# Altium schematic sheet DRV8301.SchDoc
size A3; SheetNumber: 4; SheetTotal: 5
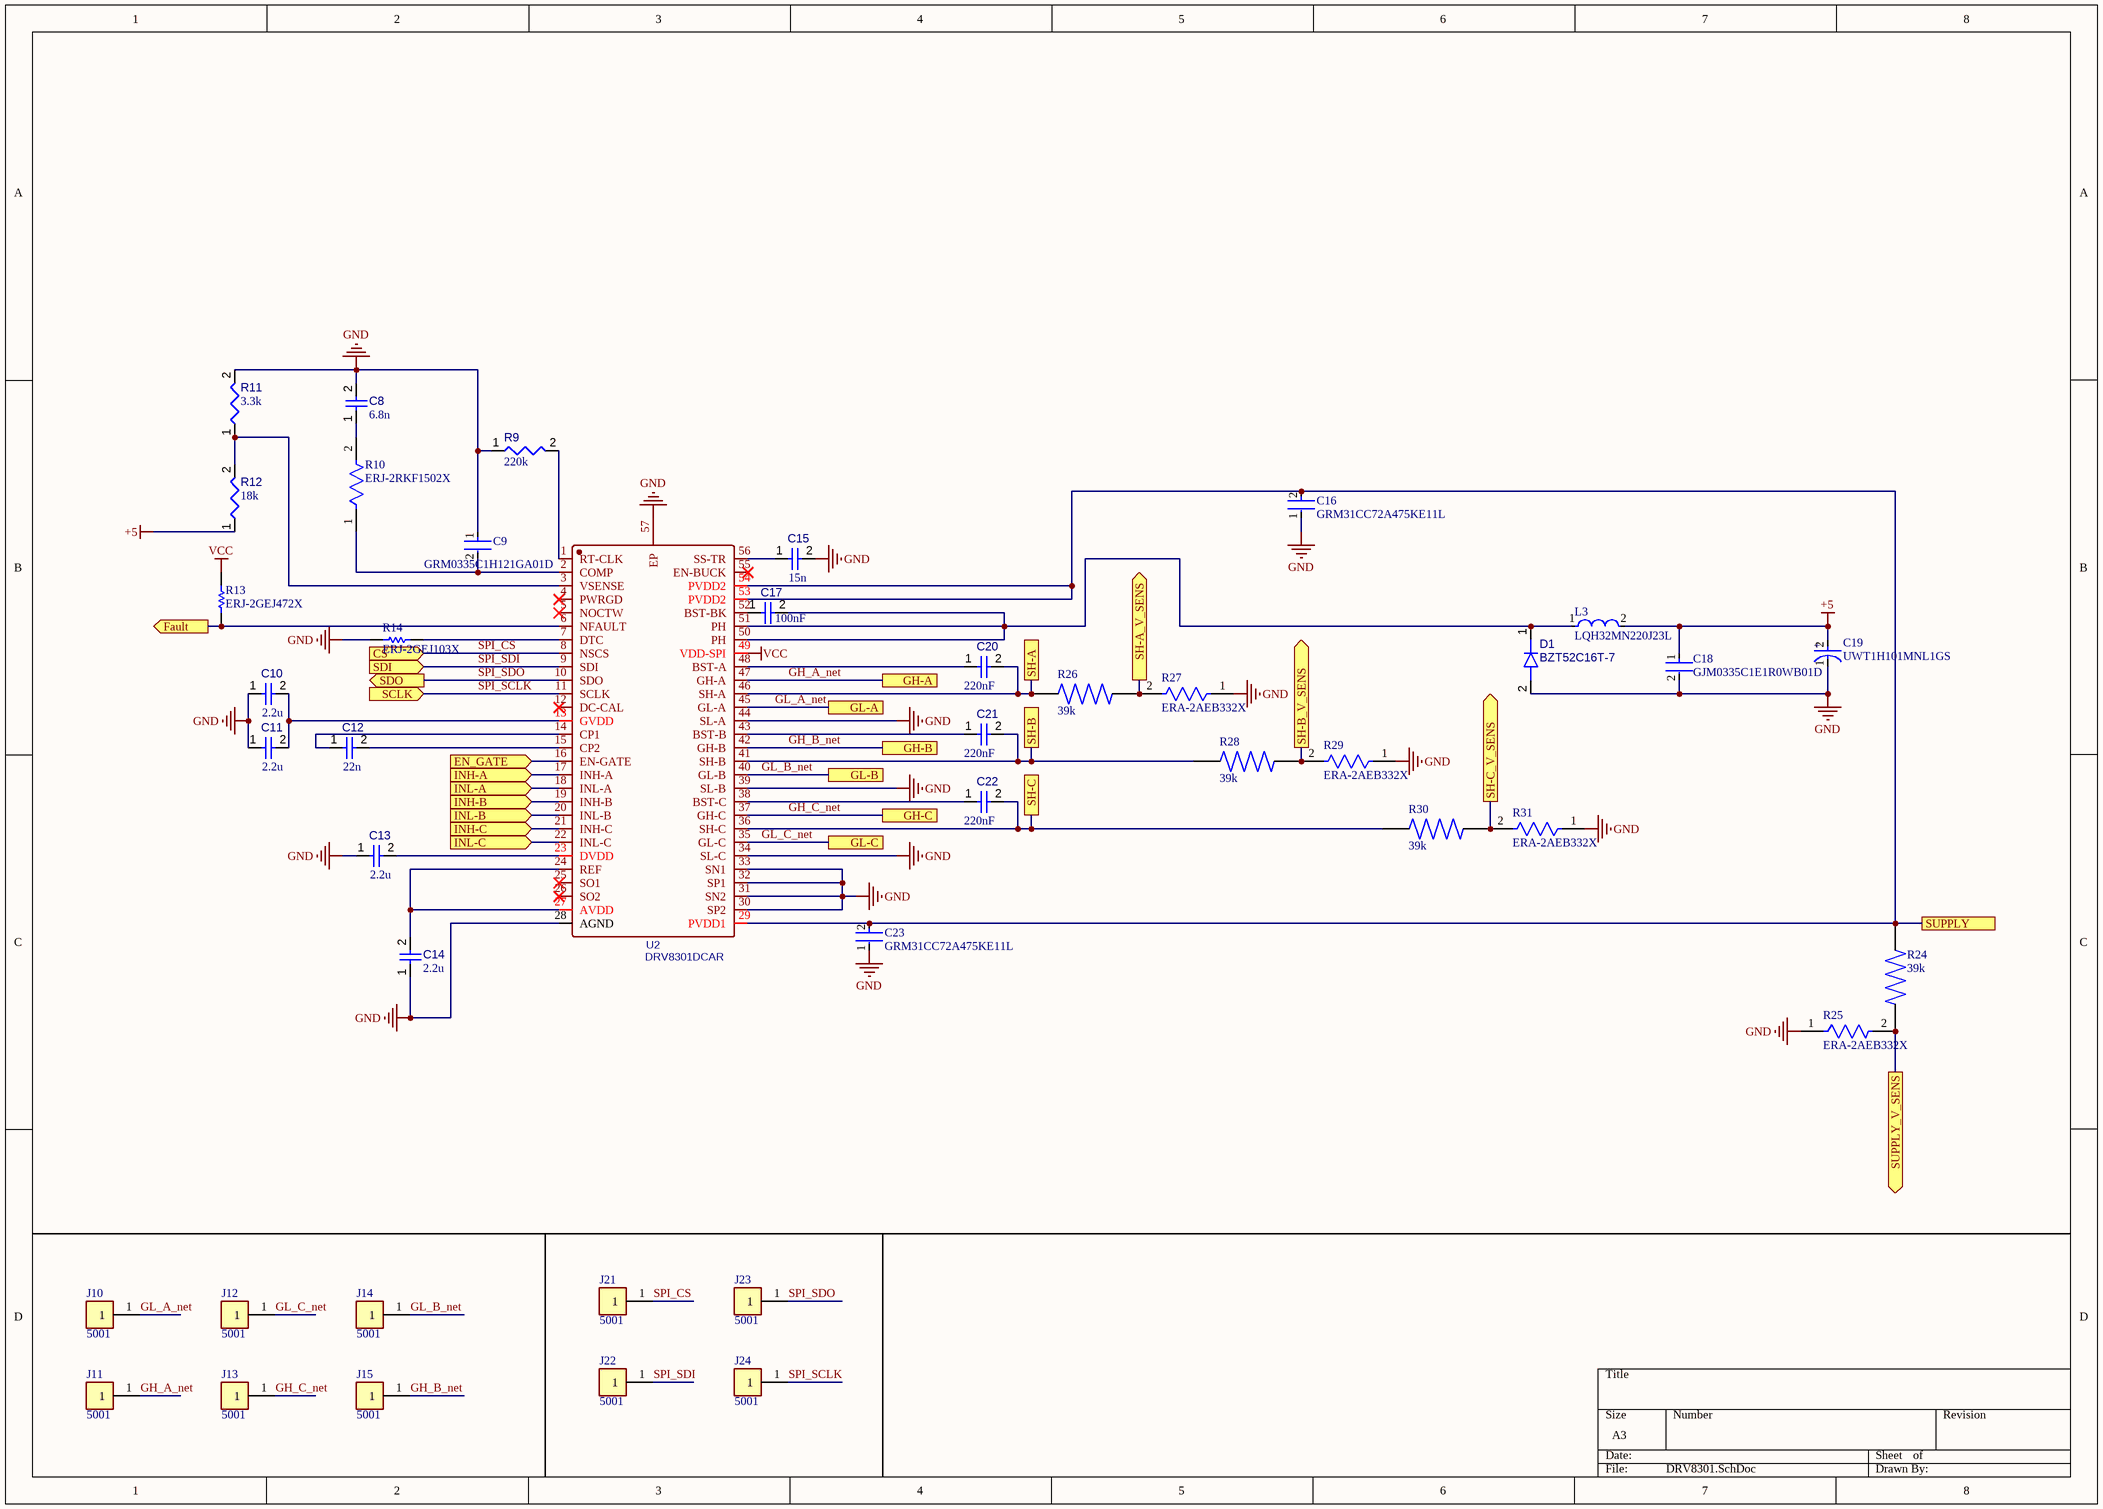
[diagram p0: DRV8301.SchDoc]

## Parts
C8  value 6.8n  [CAP-0402]  (hidden comment: C0402C682K5RECAUTO)
C9  GRM0335C1H121GA01D  [FP-GRM033-0_03-IPC_A]
C10  value 2.2u  [CAP-0805]  (hidden comment: C0805C225J4REC7800)
C11  value 2.2u  [CAP-0805]  (hidden comment: C0805C225J4REC7800)
C12  value 22n  [CAP-0402]  (hidden comment: C0402C223K5RECAUTO)
C13  value 2.2u  [CAP-0805]  (hidden comment: C0805C225J4REC7800)
C14  value 2.2u  [CAP-0805]  (hidden comment: C0805C225J4REC7800)
C15  value 15n  [CAP-0402]  (hidden comment: C0402C153J5REC7867)
C16  GRM31CC72A475KE11L  [FP-GRM31C-0_3-e0_3_0_9-MFG]
C17  value 100nF  [CAP-0805]  (hidden comment: MT05B104M500BD)
C18  GJM0335C1E1R0WB01D  [FP-GJM033-0_03-IPC_A]
C19  UWT1H101MNL1GS  [FP-UWT1H101MNL1GS-MFG]
C20  value 220nF  [CAP-0805]  (hidden comment: C0805C224J1REC7800)
C21  value 220nF  [CAP-0805]  (hidden comment: C0805C224J1REC7800)
C22  value 220nF  [CAP-0805]  (hidden comment: C0805C224J1REC7800)
C23  GRM31CC72A475KE11L  [FP-GRM31C-0_3-e0_3_0_9-MFG]
D1  BZT52C16T-7  [SODFL160X65-2N]
J10  5001  [FP-5001-MFG]
J11  5001  [FP-5001-MFG]
J12  5001  [FP-5001-MFG]
J13  5001  [FP-5001-MFG]
J14  5001  [FP-5001-MFG]
J15  5001  [FP-5001-MFG]
J21  5001  [FP-5001-MFG]
J22  5001  [FP-5001-MFG]
J23  5001  [FP-5001-MFG]
J24  5001  [FP-5001-MFG]
L3  LQH32MN220J23L  [FP-LQH32CH_23-MFG]
R9  value 220k  [CAP-0603]  (hidden comment: WR06X2203FTL)
R10  ERJ-2RKF1502X  [FP-ERJ2R-MFG]
R11  value 3.3k  [CAP-0603]  (hidden comment: RMCF0603FT3K30)
R12  value 18k  [CAP-0603]  (hidden comment: RMCF0603FT18K0)
R13  ERJ-2GEJ472X  [RESC1005X40X25LL05T05]
R14  ERJ-2GEJ103X  [RESC1005X40X25ML05T05]
R24  value 39k  [RESC6332X120N]  (hidden comment: 352239KJT)
R25  ERA-2AEB332X  [FP-ERA2A-MFG]
R26  value 39k  [RESC6332X120N]  (hidden comment: 352239KJT)
R27  ERA-2AEB332X  [FP-ERA2A-MFG]
R28  value 39k  [RESC6332X120N]  (hidden comment: 352239KJT)
R29  ERA-2AEB332X  [FP-ERA2A-MFG]
R30  value 39k  [RESC6332X120N]  (hidden comment: 352239KJT)
R31  ERA-2AEB332X  [FP-ERA2A-MFG]
U2  DRV8301DCAR  [IC-HTSSOP-56-THERM]

## Ports
CS (in), EN_GATE (in), Fault (out), GH-A, GH-B, GH-C, GL-A, GL-B, GL-C, INH-A (in), INH-B (in), INH-C (in), INL-A (in), INL-B (in), INL-C (in), SCLK (in), SDI (in), SDO (out), SH-A, SH-A_V_SENS (out), SH-B, SH-B_V_SENS (out), SH-C, SH-C_V_SENS (out), SUPPLY, SUPPLY_V_SENS (out)

## Nets
+5: C18.1 C19.2(A) L3.2 R12.1
GND: C8.2 C9.1 C10.1 C11.1 C13.1 C14.1 C15.2 C16.1 C18.2 C19.1(C) C23.1 D1.2(A) R9.1 R11.2 R14.1 R25.1 R27.1 R29.1 R31.1 U2.28(AGND) U2.30(SP2) U2.31(SN2) U2.32(SP1) U2.33(SN1) U2.34(SL-C) U2.39(SL-B) U2.44(SL-A) U2.57(EP)
VCC: R13.2 U2.49(VDD-SPI)
EN_GATE: U2.16(EN-GATE) ; port EN_GATE
Fault: R13.1 U2.6(NFAULT) ; port Fault
GH_A_net: J11.1 U2.47(GH-A) ; port GH-A
GH_B_net: J15.1 U2.42(GH-B) ; port GH-B
GH_C_net: J13.1 U2.37(GH-C) ; port GH-C
GL_A_net: J10.1 U2.45(GL-A) ; port GL-A
GL_B_net: J14.1 U2.40(GL-B) ; port GL-B
GL_C_net: J12.1 U2.35(GL-C) ; port GL-C
INH-A: U2.17(INH-A) ; port INH-A
INH-B: U2.19(INH-B) ; port INH-B
INH-C: U2.21(INH-C) ; port INH-C
INL-A: U2.18(INL-A) ; port INL-A
INL-B: U2.20(INL-B) ; port INL-B
INL-C: U2.22(INL-C) ; port INL-C
SH-A: C20.2 R26.1 U2.46(SH-A) ; port SH-A
SH-A_V_SENS: R26.2 R27.2 ; port SH-A_V_SENS
SH-B: C21.2 R28.1 U2.41(SH-B) ; port SH-B
SH-B_V_SENS: R28.2 R29.2 ; port SH-B_V_SENS
SH-C: C22.2 R30.1 U2.36(SH-C) ; port SH-C
SH-C_V_SENS: R30.2 R31.2 ; port SH-C_V_SENS
SPI_CS: J21.1 U2.8(NSCS) ; port CS
SPI_SCLK: J24.1 U2.11(SCLK) ; port SCLK
SPI_SDI: J22.1 U2.9(SDI) ; port SDI
SPI_SDO: J23.1 U2.10(SDO) ; port SDO
SUPPLY: C16.2 C23.2 R24.1 U2.29(PVDD1) U2.53(PVDD2) U2.54(PVDD2) ; port SUPPLY
SUPPLY_V_SENS: R24.2 R25.2 ; port SUPPLY_V_SENS
NetC8_1: C8.1 R10.2
NetC9_2: C9.2 R10.1 U2.2(COMP)
NetC10_2: C10.2 C11.2 U2.13(GVDD)
NetC12_1: C12.1 U2.14(CP1)
NetC12_2: C12.2 U2.15(CP2)
NetC13_2: C13.2 U2.23(DVDD)
NetC14_2: C14.2 U2.24(REF) U2.27(AVDD)
NetC15_1: C15.1 U2.56(SS-TR)
NetC17_1: C17.1 U2.52(BST-BK)
NetC17_2: C17.2 D1.1(K) L3.1 U2.50(PH) U2.51(PH)
NetC20_1: C20.1 U2.48(BST-A)
NetC21_1: C21.1 U2.43(BST-B)
NetC22_1: C22.1 U2.38(BST-C)
NetR9_2: R9.2 U2.1(RT-CLK)
NetR11_1: R11.1 R12.2 U2.3(VSENSE)
NetR14_2: R14.2 U2.7(DTC)

Not connected (* = marked no-connect by the designer): U2 4(PWRGD)* 5(NOCTW)* 12(DC-CAL)* 25(SO1)* 26(SO2)* 55(EN-BUCK)*

## Notes on the sheet
- (in symbol CMP-2000-07373-2) +

## Library data of the parts
C8 = CMP-001-00086-1: Ceramic Capacitor, Multilayer, Ceramic, 50V, 10% +Tol, 10% -Tol, X7R, 15% TC, 0.0068uF, Surface Mount, 0402; Capacitor Type: Ceramic; Case/Package: 0402; Pins: 2; RoHS Compliant: Yes
C9 = CMP-06035-001982-1: Chip Multilayer Ceramic Capacitors for General Purpose, 0201, 120pF, C0G, 30ppm/°C, 2%, 50V; Case/Package: 0201; Capacitance: 120pF; Case Code (Metric): 0603; Case Code (Imperial): 0201; Weight: 1.2E-05oz; Max Operating Temperature: 125°C; Dielectric: C0G; Width: 0.3mm; Thickness: 300um; Package Quantity: 15000; Min Operating Temperature: -55°C; Height: 0.3mm; Termination: SMD/SMT; Length: 0.6mm; Tolerance: 2%; Packaging: Tape and Reel; Resistor Type: Ceramic; Voltage Rating (DC): 50V
C10 C11 C13 C14 = CMP-001-00084-1: ESD SMD Comm X7R 0805 (2012Metric) Ceramic Capacitor 0.079Lx0.049W 2.00mmx1.25mm X7R ±5% 2.2muF
C12 = CMP-001-00085-1: Ceramic Capacitor, Multilayer, Ceramic, 50V, 10% +Tol, 10% -Tol, X7R, 15% TC, 0.022uF, Surface Mount, 0402; RoHS Compliant: Yes; Pins: 2; Case/Package: 0402; Capacitor Type: Ceramic
C15 = CMP-001-00087-1: Ceramic Capacitor, Multilayer, Ceramic, 50V, 5% +Tol, 5% -Tol, X7R, 15% TC, 0.015uF, Surface Mount, 0402; RoHS Compliant: Yes; Case/Package: 0402
C16 C23 = CMP-06035-000119-2: Chip Multilayer Ceramic Capacitors for General Purpose, 1206, 4.7uF, X7S, 22%, 10%, 100V
C17 = CMP-001-00088-1: Cap. SMD, 0805, X7R, 100nF, 20%, 50V,
C18 = CMP-2010-00803-2: Ceramic Capacitor 1pF ±0.05pF 25V C0G 0201 (0603 Metric); Packaging: Tape and Reel; Lead Free: Lead Free; Voltage Rating (DC): 25V; Termination: SMD/SMT; Capacitance: 1pF; Height: 0.3mm; Case Code (Imperial): 0201; Thickness: 0.013inch; Max Operating Temperature: 125°C; Length: 0.6mm; Case/Package: 0201; Voltage Rating: 25V; Case Code (Metric): 0603; Radiation Hardening: No; Width: 0.3mm; Min Operating Temperature: -55°C; Mount: Surface Mount; Package Quantity: 15000; Depth: 0.3mm; Dielectric: C0G
C19 = CMP-2000-07373-2: CAP ALUM 100UF 20% 50V SMD; Leakage Current: 3uA; Ripple Current: 140mA; Life (Hours): 1000Hour; Dissipation Factor: 0.14%; Dielectric Material: Aluminium; Termination: SMD/SMT; Tolerance: 20%; Package Quantity: 500; Capacitance: 100uF; Height: 10mm; REACH SVHC: No SVHC; Case/Package: Radial; Series: WT; Diameter: 8mm; Voltage Rating: 50V; Construction: Cylindrical; Length: 10mm; Min Operating Temperature: -55°C; Max Operating Temperature: 105°C; Voltage Rating (DC): 50V; Packaging: Tape and Reel; Voltage: 50V; Mount: Surface Mount; Ripple Current (AC): 140mA; Radiation Hardening: No; Number of Pins: 2; Lead Free: Lead Free; Height - Seated (Max): 0.413inch; RoHS Compliant: Yes
C20-C22 = CMP-001-00089-1: Cap Ceramic 0.22uF 100V X7R 5% SMD 0805 125°C T/R; Case/Package: 0805
D1 = CMP-004-00031-1: Zener Diode, 16V V(Z), 5.56%, 0.3W, Silicon, Unidirectional; Min Operating Temperature: -65°C; RoHS Compliant: Yes; Pins: 2; Max Operating Temperature: 150°C
J10-J15 J21-J24 = CMP-2000-05181-2: PC TEST POINT MINIATURE BLACK; Body Material: Bronze; Plating: Silver; Inside Diameter: 1.27mm; Hole Diameter: 1.6mm; Number of Ports: 1; Outside Diameter: 2.54mm; Insulation: Insulated; Insulation Material: Nylon; Mount: Through Hole; RoHS Compliant: Yes; Series: THM; Height: 0.3inch; Termination: Through Hole; Material: Nylon; Packaging: Bulk; Contact Material: Bronze; REACH SVHC: No SVHC; Contact Plating: Silver; Orientation: Straight; Lead Free: Lead Free; Package Quantity: 100; Length: 7.62mm; Flammability Rating: UL94 V-0; Number of Contacts: 1; Diameter: 2.54mm; Housing Color: Black; Color: Black
L3 = CMP-06042-014813-2: Wire Wound Ferrite Inductor for General Circuits 22μH ±5% 2.8Ω 150mA 1210; Inductance: 22uH; DC Resistance (DCR): 2.8R; Shielding: Unshielded; Self Resonant Frequency: 14MHz; Test Frequency: 1MHz; Q Factor: 35; RoHS Compliant: Yes; Core Material: Ferrite; Weight: 0.002116oz; Mount: Surface Mount; Min Operating Temperature: -40°C; Lead Free: Lead Free; Height - Seated (Max): 0.087inch; Width: 0.098inch; Max Operating Temperature: 85°C; REACH SVHC: No SVHC; Radiation Hardening: No; Length: 3.5mm; DC Current: 150mA; Packaging: Tape and Reel; Package Quantity: 2000; Inductance Tolerance: 5%; Resistor Type: Wirewound; Case/Package: 1210; Termination: SMD/SMT; Series: LQH32M; Current Rating: 150mA; Depth: 2.7mm; Tolerance: 5%; Max DC Current: 150mA; Military Standard: Not; Height: 2mm; Rated Current-Max: 150mA; Case Code (Imperial): 1210; Case Code (Metric): 3225
R9 = CMP-009-00179-1: Fixed Resistor, Metal Glaze/thick Film, 0.1W, 220000ohm, 75V, 1% +/-Tol, 100ppm/Cel, Surface Mount, 0603; Power: 100mW; Min Operating Temperature: -55°C; Max Operating Temperature: 155°C; Case/Package: 0603; RoHS Compliant: Yes; Tolerance: 1%; Pins: 2; Mounting Technology: Surface Mount
R10 = CMP-2002-00694-4: RES SMD 15K OHM 1% 1/10W 0402; Manufacturer: Panasonic; Automotive Grade: Grade 0; Voltage Rating: 50V; Resistance: 15kΩ; Temperature Coefficient: 100ppm/°C; Power Rating: 0.1W; Value: 15kΩ; ComponentLink2URL: https://industrial.panasonic.com/cdbs/www-data/pdf/RDA0000/AOA0000C304.pdf; Automotive: Yes; Temperature: -55°C to +155°C; Height: 0.4mm; Digikey Description: RES SMD 15K OHM 1% 1/10W 0402; Category: Res; Device Class L2: Resistors; Device Class L1: Passive Components; Package: ERJ2R; Temperature Range Low: -55°C; Tolerance: 1%; Series: ERJ; Manufacturer Part Number: ERJ-2RKF1502X; Footprint Url: https://b2b-api.panasonic.eu/file_stream/pids/fileversion/1180; Mouser Description: Res Thick Film 1.0 x 0.5 mm 15K Ohm 1% 0.1W(1/10W) 100ppm/ C Molded SMD Punched Carrier T/R; Composition: Thick Film; Lead Free: Yes; Device Class L3: Chip SMD Resistors; Octopart: https://octopart.com/erj-2rkf1502x-panasonic-55404985; RoHS: TRUE; Temperature Range High: +155°C; ComponentLink2Description: Datasheet
R11 = CMP-009-00177-1: Fixed Resistor, Metal Glaze/thick Film, 0.1W, 3300ohm, 75V, 1% +/-Tol, 100ppm/Cel, Surface Mount, 0603; Power: 100mW; Min Operating Temperature: -55°C; Mounting Technology: Surface Mount; Tolerance: 1%; Case/Package: 0603; Max Operating Temperature: 155°C; RoHS Compliant: Yes; Pins: 2
R12 = CMP-009-00178-1: Fixed Resistor, Metal Glaze/thick Film, 0.1W, 18000ohm, 75V, 1% +/-Tol, 100ppm/Cel, Surface Mount, 0603; Power: 100mW; Max Operating Temperature: 155°C; Case/Package: 0603; Tolerance: 1%; Pins: 2; Mounting Technology: Surface Mount; Min Operating Temperature: -55°C; RoHS Compliant: Yes
R13 = CMP-2002-00544-1: Manufacturer: Panasonic; Part Number: ERJ-2GEJ472X
R14 = CMP-2002-00433-1: Manufacturer: Panasonic; Part Number: ERJ-2GEJ103X
R24 R26 R28 R30 = CMP-009-00181-1: 3522 39K 5% 3W; Design Item ID: 352239KJT; MP: 352239KJT; Pins: 2; Case/Package: None; Price: None; Availability: Unavailable; Source: 352239KJT.SchLib; Component Type: Standard
R25 R27 R29 R31 = CMP-2002-05884-2: NexarPartId: 9251384; Voltage Rating (DC): 25V; Temperature Coefficient: 25ppm/°C; Tolerance: 0.1%; Resistance: 3.3kΩ; Power Rating: 63mW; Case/Package: 0402; Number of Terminations: 2; Military Standard: Not; Case Code (Imperial): 0402; Length: 1mm; Contact Plating: Tin; Termination: SMD/SMT; Schedule B: 8533210045, 8533210045; Voltage Rating: 25V; Lead Free: Lead Free; Min Operating Temperature: -55°C; REACH SVHC: No SVHC; Max Power Dissipation: 63mW; Weight: 793.786648µg; RoHS: Compliant; Depth: 500µm; Packaging: Cut Tape; Max Operating Temperature: 155°C; Width: 500µm; Case Code (Metric): 1005; Height: 350µm; Composition: Thin Film; Lifecycle Status: Production; Radiation Hardening: No; Number of Pins: 2; Mount: Surface Mount
U2 = DRV8301DCAR: BOM_Manufacturer: TI(德州仪器); Contributor: LCSC; BOM_Supplier: LCSC; BOM_Supplier Part: C98969; BOM_Manufacturer Part: DRV8301DCAR; BOM_JLCPCB Part Class: Extended Part; spicePre: U; spiceSymbolName: DRV8301DCAR